# EAGLE design Spring Terminal Large Pushbutton v0.2 (EAGLE 7.1.0)
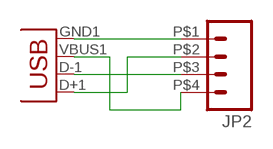
[diagram p0: schematic, sheet 1]

## Parts
JP1  USB  [USB-B-MICRO-SMD_V03]
JP2  M04LARGE_PUSHBTN_SPRING_TERM  [1X04_LARGE_PUSHBTN_SPRING_TERM]

## Nets
3V3: JP1.VBUS1(VBUS) JP2.P$4
D+: JP1.D+1(D+) JP2.P$2
D-: JP1.D-1(D-) JP2.P$3
GND: JP1.GND1(GND) JP2.P$1

## Library data of the parts
JP1 = SparkFun-Connectors:USB: USB Connectors USB-B-PTH is fully proven SKU : PRT-00139/CONN-08278 USB-miniB is fully proven SKU : PRT-00587 USB-A-PCB is untested. USB-A-H is throughly reviewed, but untested. Spark Fun Electronics SKU : PRT-00437 USB-B-SMT is throughly reviewed, but untested. Needs silkscreen touching up. USB-A-S has not been used/tested USB-MB-H has not been used/tested USB-MICROB has been used. CONN-09505
JP2 = SparkFun-Connectors:M04: Header 4 Standard 4-pin 0.1" header. Use with straight break away headers (SKU : PRT-00116), right angle break away headers (PRT-00553), swiss pins (PRT-00743), machine pins (PRT-00117), and female headers (PRT-00115). Molex polarized connector foot print use with SKU : PRT-08231 with associated crimp pins and housings. 1MM SMD Version SKU: PRT-10208

## Board
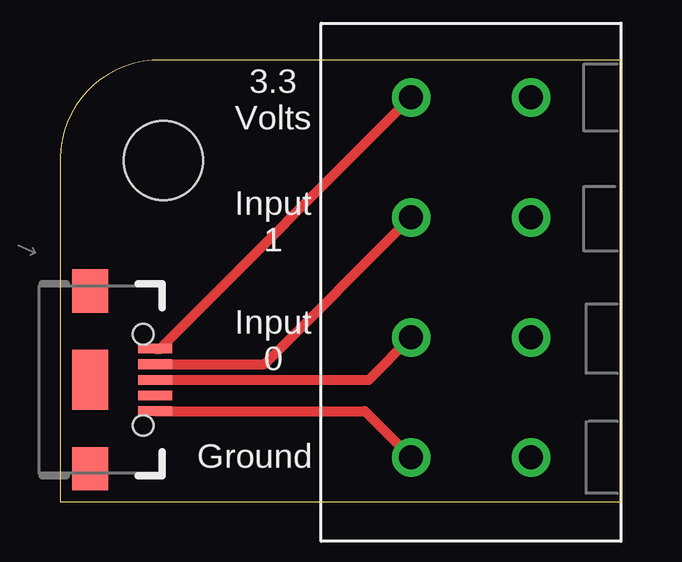
[diagram p1: board, top side]
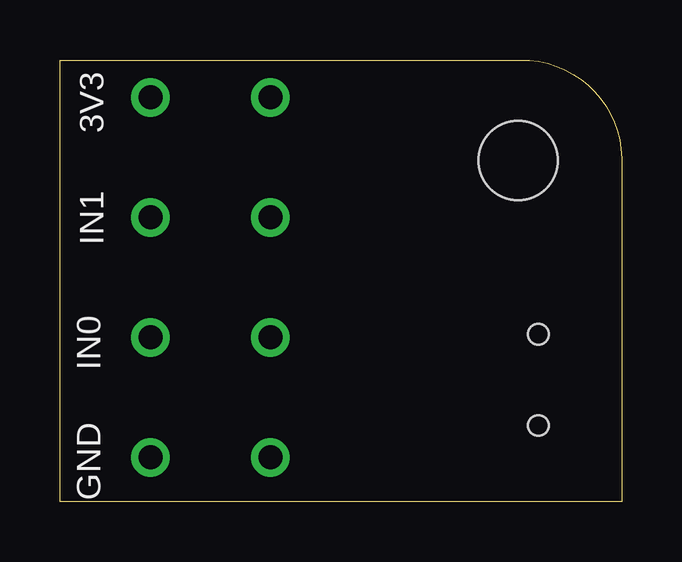
[diagram p2: board, bottom side, seen from below]

Size 23.42 x 18.41 mm. Coordinates in mm from the lower left corner, seen from the top.
Outline: 4.22,18.41 23.42,18.41 23.42,0 0,0 0,14.32 arc-90 4.22,18.41
Outline: 4.3,18.4 4.22,18.41
Copper layers (1*16): Top 0.035mm / dielectric 1.5mm / Bottom 0.035mm
Design rules "SparkFun": minimum track width 8mil, minimum drill 20mil, track to track 8mil, track to pad 8mil, pad to pad 8mil, via to via 8mil, smd to smd 8mil, copper to edge 10mil, drill to drill 8mil, minimum pad ring 12mil, minimum via ring 10mil, stop-mask expansion 4mil, vias tented up to drill 25mil, thermal gap 10mil

### Footprints (pad centres in the part's own frame; a part is rotated, then mirrored left to right if it is on the bottom)
USB-B-MICRO-SMD_V03 = smd 1.4 x 0.4: D+1 2.7,0; D-1 2.7,0.65; GND1 2.7,-1.3; ID1 2.7,-0.65; VBUS1 2.7,1.3 | smd 1.5 x 1.8: SHIELD1 0,3.7; SHIELD2 0,-3.7 | smd 1.5 x 2.5: SHIELD3 0,0 | hole 0.85: 2.2,1.9; 2.2,-1.9
1X04_LARGE_PUSHBTN_SPRING_TERM = drill 1: P$1 -7.3,2.5; P$2 -2.3,2.5; P$3 2.7,2.5; P$4 7.7,2.5; P$5 7.7,-2.5; P$6 2.7,-2.5; P$7 -2.3,-2.5; P$8 -7.3,-2.5
STAND-OFF = hole 3.302: 0,0

### Placement (x,y rotation side)
JP1  1.27,5.08 0 top
JP2  17.14,9.14 90 top
U$1  [STAND-OFF]  4.32,14.22 0 top

### Tracks (layer width: path | path; a pad name or v marks a point on that pad's centre or on a via)
3V3
  Top 0.406: JP1.VBUS1 4.22,6.38 4.22,6.42 JP2.P$4
D+
  Top 0.406: JP1.D+1 12.88,5.08 JP2.P$2
D-
  Top 0.406: JP1.D-1 8.53,5.73 JP2.P$3
GND
  Top 0.406: JP1.GND1 12.71,3.78 JP2.P$1

### Text on the board
tPlace: 3.3 / Volts | Input / 1 | Input / 0 | Ground
bPlace: 3V3 | IN1 | IN0 | GND